# EAGLE schematic BPF_eval (EAGLE 8.4.3)
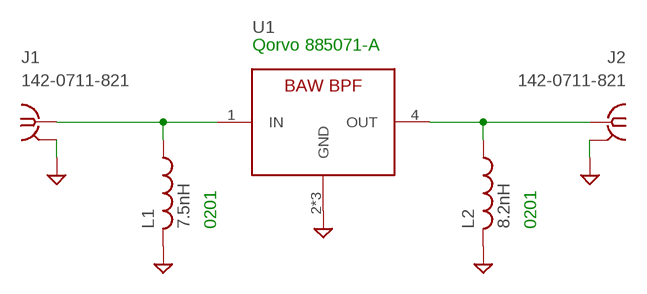
[diagram p0: schematic, sheet 1]

## Parts
J1  142-0711-821  SMA-142-0711-821/826  [J502-ND-142-0711-821/826]
J2  142-0711-821  SMA-142-0711-821/826  [J502-ND-142-0711-821/826]
L1  7.5nH  L-USL0201  [L0201]
L2  8.2nH  L-USL0201  [L0201]
U1  885071-A  [FIL_B39162B9417K610]

## Nets
GND: J1.G@1 J1.G@2 J1.G@3 J1.G@4 J2.G@1 J2.G@2 J2.G@3 J2.G@4 L1.2 L2.2 U1.2(GND) U1.3(GND) U1.5(GND)
N$1: J1.1 L1.1 U1.1(IN)
N$2: J2.1 L2.1 U1.4(OUT)

## Notes on the sheet
- Qorvo 885071-A
- 0201 | 0201

## Library data of the parts
J1 J2 = con-coax:SMA-: SMA 50 Ohm End Launch Jack Receptacle - Round Contact Johnson Components Source: www.johnsoncomponents.com .. J502-ND.pdf; MF: JOHNSON COMPONENTS; MPN: 142-0711-821; OC_FARNELL: 1019328; OC_NEWARK: 16F3627
L1 L2 = rcl:L-US: INDUCTOR, American symbol
U1 = 885071_A:885071-A: 2.4GHz BPF